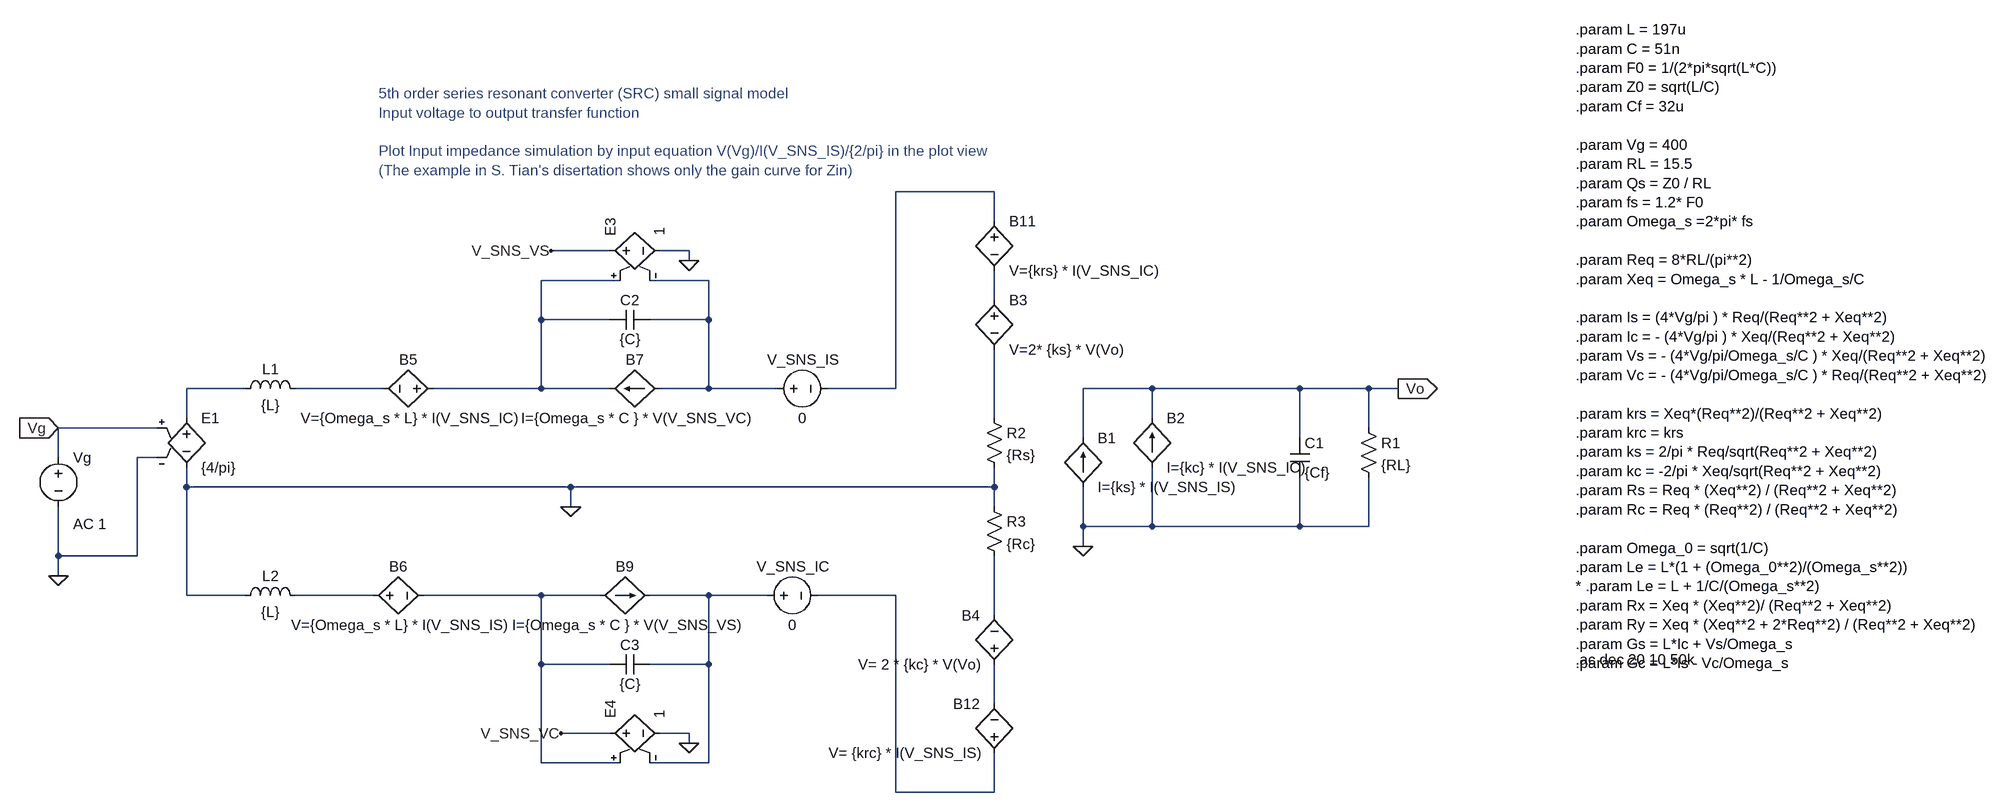
[diagram p0: schematic src_5th_eq_vo-vg_and_Zin.asc]
src_5th_eq_vo-vg_and_Zin.asc, the LTspice schematic file:
Version 4
SHEET 1 2152 800
WIRE 544 -336 384 -336
WIRE 544 -288 544 -336
WIRE -80 -240 -176 -240
WIRE 48 -240 0 -240
WIRE 48 -224 48 -240
WIRE -64 -192 -192 -192
WIRE 80 -192 -16 -192
WIRE 544 -160 544 -208
WIRE -192 -128 -192 -192
WIRE -80 -128 -192 -128
WIRE 80 -128 80 -192
WIRE 80 -128 -16 -128
WIRE -672 -16 -768 -16
WIRE -448 -16 -592 -16
WIRE -192 -16 -192 -128
WIRE -192 -16 -368 -16
WIRE -80 -16 -192 -16
WIRE 80 -16 80 -128
WIRE 80 -16 0 -16
WIRE 192 -16 80 -16
WIRE 384 -16 384 -336
WIRE 384 -16 272 -16
WIRE 800 -16 688 -16
WIRE 1040 -16 800 -16
WIRE 1152 -16 1040 -16
WIRE 1200 -16 1152 -16
WIRE -768 32 -768 -16
WIRE 544 32 544 -80
WIRE 800 32 800 -16
WIRE -816 48 -976 48
WIRE 1152 48 1152 -16
WIRE 688 64 688 -16
WIRE 1040 64 1040 -16
WIRE -976 96 -976 48
WIRE -816 96 -848 96
WIRE -768 144 -768 112
WIRE -144 144 -768 144
WIRE 544 144 544 112
WIRE 544 144 -144 144
WIRE -144 176 -144 144
WIRE 544 176 544 144
WIRE 688 208 688 144
WIRE 800 208 800 112
WIRE 800 208 688 208
WIRE 1040 208 1040 128
WIRE 1040 208 800 208
WIRE 1152 208 1152 128
WIRE 1152 208 1040 208
WIRE 688 240 688 208
WIRE -976 256 -976 176
WIRE -848 256 -848 96
WIRE -848 256 -976 256
WIRE -976 288 -976 256
WIRE -768 320 -768 144
WIRE -672 320 -768 320
WIRE -464 320 -592 320
WIRE -192 320 -384 320
WIRE -96 320 -192 320
WIRE 80 320 -16 320
WIRE 176 320 80 320
WIRE 384 320 256 320
WIRE 544 352 544 256
WIRE -192 432 -192 320
WIRE -80 432 -192 432
WIRE 80 432 80 320
WIRE 80 432 -16 432
WIRE 544 496 544 432
WIRE -80 544 -160 544
WIRE 48 544 0 544
WIRE 48 560 48 544
WIRE -192 592 -192 432
WIRE -64 592 -192 592
WIRE 80 592 80 432
WIRE 80 592 -16 592
WIRE 384 640 384 320
WIRE 544 640 544 576
WIRE 544 640 384 640
FLAG -144 176 0
FLAG -976 288 0
FLAG 688 240 0
FLAG 1200 -16 Vo
IOPIN 1200 -16 Out
FLAG 48 -224 0
FLAG -176 -240 V_SNS_VS
FLAG 48 560 0
FLAG -160 544 V_SNS_VC
FLAG -976 48 Vg
IOPIN -976 48 In
SYMBOL res 1136 32 R0
SYMATTR InstName R1
SYMATTR Value {RL}
SYMBOL cap 1024 64 R0
SYMATTR InstName C1
SYMATTR Value {Cf}
SYMBOL bi2 688 64 R0
SYMATTR InstName B1
SYMATTR Value I={ks} * I(V_SNS_IS)
SYMBOL bi2 800 32 R0
SYMATTR InstName B2
SYMATTR Value I={kc} * I(V_SNS_IC)
SYMBOL voltage -976 80 R0
WINDOW 123 24 124 Left 2
WINDOW 39 0 0 Left 2
SYMATTR Value2 AC 1
SYMATTR InstName Vg
SYMATTR Value ""
SYMBOL e -768 16 R0
SYMATTR InstName E1
SYMATTR Value {4/pi}
SYMBOL ind -688 0 R270
WINDOW 0 32 56 VTop 2
WINDOW 3 5 56 VBottom 2
SYMATTR InstName L1
SYMATTR Value {L}
SYMBOL bv 544 -176 R0
SYMATTR InstName B3
SYMATTR Value V=2* {ks} * V(Vo)
SYMBOL ind -688 336 R270
WINDOW 0 32 56 VTop 2
WINDOW 3 5 56 VBottom 2
SYMATTR InstName L2
SYMATTR Value {L}
SYMBOL bv 544 448 R180
WINDOW 0 24 96 Left 2
WINDOW 3 24 16 Left 2
SYMATTR InstName B4
SYMATTR Value V= 2 * {kc} * V(Vo)
SYMBOL res 528 16 R0
SYMATTR InstName R2
SYMATTR Value {Rs}
SYMBOL res 528 160 R0
SYMATTR InstName R3
SYMATTR Value {Rc}
SYMBOL voltage 176 -16 R270
WINDOW 0 32 56 VTop 2
WINDOW 3 -32 56 VBottom 2
SYMATTR InstName V_SNS_IS
SYMATTR Value 0
SYMBOL cap -16 -144 R90
WINDOW 0 0 32 VBottom 2
WINDOW 3 32 32 VTop 2
SYMATTR InstName C2
SYMATTR Value {C}
SYMBOL bi2 -80 -16 R270
WINDOW 0 32 40 VTop 2
WINDOW 3 -32 40 VBottom 2
SYMATTR InstName B7
SYMATTR Value I={Omega_s * C } * V(V_SNS_VC)
SYMBOL cap -80 448 R270
WINDOW 0 32 32 VTop 2
WINDOW 3 0 32 VBottom 2
SYMATTR InstName C3
SYMATTR Value {C}
SYMBOL bi2 -16 320 R90
WINDOW 0 -32 40 VBottom 2
WINDOW 3 32 40 VTop 2
SYMATTR InstName B9
SYMATTR Value I={Omega_s * C } * V(V_SNS_VS)
SYMBOL bv 544 -304 R0
SYMATTR InstName B11
SYMATTR Value V={krs} * I(V_SNS_IC)
SYMBOL bv 544 592 R180
WINDOW 0 24 96 Left 2
WINDOW 3 24 16 Left 2
SYMATTR InstName B12
SYMATTR Value V= {krc} * I(V_SNS_IS)
SYMBOL voltage 160 320 R270
WINDOW 0 32 56 VTop 2
WINDOW 3 -32 56 VBottom 2
SYMATTR InstName V_SNS_IC
SYMATTR Value 0
SYMBOL e -96 -240 R270
SYMATTR InstName E3
SYMATTR Value 1
SYMBOL e -96 544 R270
SYMATTR InstName E4
SYMATTR Value 1
SYMBOL bv -352 -16 R90
WINDOW 0 -32 56 VBottom 2
WINDOW 3 32 56 VTop 2
SYMATTR InstName B5
SYMATTR Value V={Omega_s * L} * I(V_SNS_IC)
SYMBOL bv -480 320 R270
WINDOW 0 32 56 VTop 2
WINDOW 3 -32 56 VBottom 2
SYMATTR InstName B6
SYMATTR Value V={Omega_s * L} * I(V_SNS_IS)
TEXT 1488 -600 Left 2 !.param L = 197u\n.param C = 51n\n.param F0 = 1/(2*pi*sqrt(L*C))\n.param Z0 = sqrt(L/C)\n.param Cf = 32u\n \n.param Vg = 400\n.param RL = 15.5\n.param Qs = Z0 / RL\n.param fs = 1.2* F0\n.param Omega_s =2*pi* fs\n \n.param Req = 8*RL/(pi**2)\n.param Xeq = Omega_s * L - 1/Omega_s/C\n \n.param Is = (4*Vg/pi ) * Req/(Req**2 + Xeq**2)\n.param Ic = - (4*Vg/pi ) * Xeq/(Req**2 + Xeq**2)\n.param Vs = - (4*Vg/pi/Omega_s/C ) * Xeq/(Req**2 + Xeq**2)\n.param Vc = - (4*Vg/pi/Omega_s/C ) * Req/(Req**2 + Xeq**2)\n \n.param krs = Xeq*(Req**2)/(Req**2 + Xeq**2)\n.param krc = krs\n.param ks = 2/pi * Req/sqrt(Req**2 + Xeq**2)\n.param kc = -2/pi * Xeq/sqrt(Req**2 + Xeq**2)\n.param Rs = Req * (Xeq**2) / (Req**2 + Xeq**2)\n.param Rc = Req * (Req**2) / (Req**2 + Xeq**2)\n \n.param Omega_0 = sqrt(1/C)\n.param Le = L*(1 + (Omega_0**2)/(Omega_s**2))\n* .param Le = L + 1/C/(Omega_s**2)\n.param Rx = Xeq * (Xeq**2)/ (Req**2 + Xeq**2)\n.param Ry = Xeq * (Xeq**2 + 2*Req**2) / (Req**2 + Xeq**2)\n.param Gs = L*Ic + Vs/Omega_s\n.param Gc = L*Is - Vc/Omega_s
TEXT 1488 424 Left 2 !.ac dec 20 10 50k
TEXT -456 -496 Left 2 ;5th order series resonant converter (SRC) small signal model\nInput voltage to output transfer function\n \nPlot Input impedance simulation by input equation V(Vg)/I(V_SNS_IS)/{2/pi} in the plot view\n(The example in S. Tian's disertation shows only the gain curve for Zin)

The netlist it stands for:
* src_5th_eq_vo-vg_and_Zin.asc
R1 Vo 0 {RL}
C1 Vo 0 {Cf}
B1 0 Vo I={ks} * I(V_SNS_IS)
B2 0 Vo I={kc} * I(V_SNS_IC)
Vg Vg 0 AC 1
E1 N005 0 Vg 0 {4/pi}
L1 N005 N006 {L}
B3 N004 N007 V=2* {ks} * V(Vo)
L2 0 N008 {L}
B4 N013 N012 V= 2 * {kc} * V(Vo)
R2 N007 0 {Rs}
R3 0 N012 {Rc}
V_SNS_IS N003 N001 0
C2 N003 N002 {C}
B7 N003 N002 I={Omega_s * C } * V(V_SNS_VC)
C3 N009 N010 {C}
B9 N009 N010 I={Omega_s * C } * V(V_SNS_VS)
B11 N001 N004 V={krs} * I(V_SNS_IC)
B12 N011 N013 V= {krc} * I(V_SNS_IS)
V_SNS_IC N010 N011 0
E3 V_SNS_VS 0 N002 N003 1
E4 V_SNS_VC 0 N009 N010 1
B5 N002 N006 V={Omega_s * L} * I(V_SNS_IC)
B6 N008 N009 V={Omega_s * L} * I(V_SNS_IS)
.param L = 197u
.param C = 51n
.param F0 = 1/(2*pi*sqrt(L*C))
.param Z0 = sqrt(L/C)
.param Cf = 32u
.param Vg = 400
.param RL = 15.5
.param Qs = Z0 / RL
.param fs = 1.2* F0
.param Omega_s =2*pi* fs
.param Req = 8*RL/(pi**2)
.param Xeq = Omega_s * L - 1/Omega_s/C
.param Is = (4*Vg/pi ) * Req/(Req**2 + Xeq**2)
.param Ic = - (4*Vg/pi ) * Xeq/(Req**2 + Xeq**2)
.param Vs = - (4*Vg/pi/Omega_s/C ) * Xeq/(Req**2 + Xeq**2)
.param Vc = - (4*Vg/pi/Omega_s/C ) * Req/(Req**2 + Xeq**2)
.param krs = Xeq*(Req**2)/(Req**2 + Xeq**2)
.param krc = krs
.param ks = 2/pi * Req/sqrt(Req**2 + Xeq**2)
.param kc = -2/pi * Xeq/sqrt(Req**2 + Xeq**2)
.param Rs = Req * (Xeq**2) / (Req**2 + Xeq**2)
.param Rc = Req * (Req**2) / (Req**2 + Xeq**2)
.param Omega_0 = sqrt(1/C)
.param Le = L*(1 + (Omega_0**2)/(Omega_s**2))
* .param Le = L + 1/C/(Omega_s**2)
.param Rx = Xeq * (Xeq**2)/ (Req**2 + Xeq**2)
.param Ry = Xeq * (Xeq**2 + 2*Req**2) / (Req**2 + Xeq**2)
.param Gs = L*Ic + Vs/Omega_s
.param Gc = L*Is - Vc/Omega_s
.ac dec 20 10 50k
* 5th order series resonant converter (SRC) small signal model
* Input voltage to output transfer function
* Plot Input impedance simulation by input equation V(Vg)/I(V_SNS_IS)/{2/pi} in the plot view
* (The example in S. Tian's disertation shows only the gain curve for Zin)
.backanno
.end